# Altium schematic sheet power.SchDoc: Power
size Letter; Organization: NewAE Technology Inc.; Address1: 1083 Queen St., Suite 196; Address2: Halifax; Address3: NS; Address4: Canada B3H 0B2; SheetApproved: NO
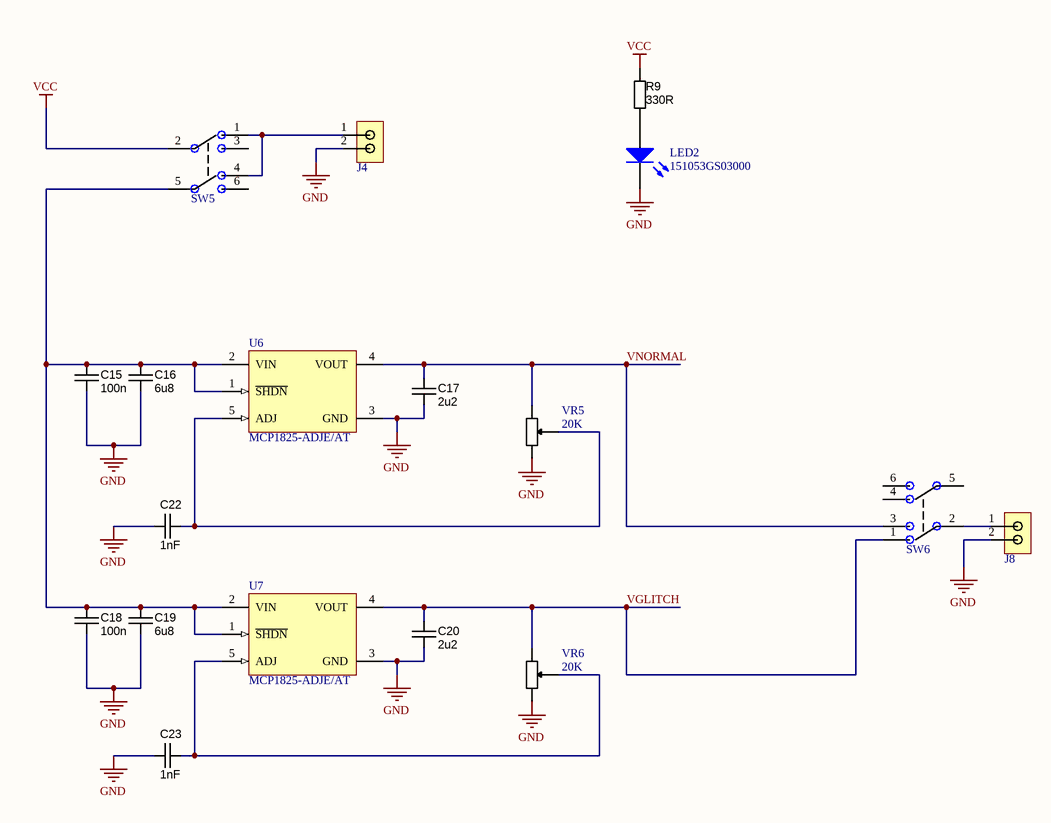
[diagram p0: power.SchDoc]

## Parts
C15  value 100n  [CAPC500P450250X550]  (hidden comment: approved sub OK)
C16  value 6u8  [CAPC500P450250X550]  (hidden comment: approved sub OK)
C17  value 2u2  [CAPC500P450250X550]  (hidden comment: approved sub OK)
C18  value 100n  [CAPC500P450250X550]  (hidden comment: approved sub OK)
C19  value 6u8  [CAPC500P450250X550]  (hidden comment: approved sub OK)
C20  value 2u2  [CAPC500P450250X550]  (hidden comment: approved sub OK)
C22  value 1nF  [CAPC500P450250X550]  (hidden comment: approved sub OK)
C23  value 1nF  [CAPC500P450250X550]  (hidden comment: approved sub OK)
J4  Jumper  [2x2.54mm_Header]  (value not drawn)
J8  Jumper  [2x2.54mm_Header]  (value not drawn)
LED2  151053GS03000  [Type 5mm]
R9  value 330R  [RESTH_AXIAL-0.4]  (hidden comment: Carbon Film)
SW5  EG2207  [EG2207]  (value not drawn)
SW6  EG2207  [EG2207]  (value not drawn)
U6  MCP1825-ADJE/AT  [TO-220-AT5]
U7  MCP1825-ADJE/AT  [TO-220-AT5]
VR5  20K  [RES_PDB18]
VR6  20K  [RES_PDB18]

## Nets
GND: C15.1 C16.1 C17.1 C18.1 C19.1 C20.1 C22.2 C23.2 J4.2 J8.2 LED2.1(K) U6.3(GND) U7.3(GND) VR5.3 VR6.3
VCC: R9.1 SW5.2(IN)
VGLITCH: C20.2 SW6.1(IN) U7.4(VOUT) VR6.1
VNORMAL: C17.2 SW6.3(IN) U6.4(VOUT) VR5.1
NetC15_2: C15.2 C16.2 C18.2 C19.2 SW5.5(IN) U6.1(~{SHDN}) U6.2(VIN) U7.1(~{SHDN}) U7.2(VIN)
NetC22_1: C22.1 U6.5(ADJ) VR5.2
NetC23_1: C23.1 U7.5(ADJ) VR6.2
NetJ4_1: J4.1 SW5.1(IN) SW5.4(IN)
NetJ8_1: J8.1 SW6.2(IN)
NetLED2_2: LED2.2(A) R9.2

Not connected (* = marked no-connect by the designer): SW5 3(IN) 6(IN); SW6 4(IN) 5(IN) 6(IN)

## Notes on the sheet
- Title:
- Date:
- Rev:
- Time:
- Project:
- Sheet
- of
- License:
- Copyright © NewAE Technology Inc.
- Approved:
- NewAE.com
- File:

## Library data of the parts
C15-C20 C22 C23 = CAPR_220n_Radial_5mm: Capacitor Ceramic 220nF 10% 50V X7R radial 5mm lead spacing; Manufacturer 1: TDK Corporation; Ratings: 50V; X7R; SCDType: spec; Tolerance: ±10%; Material: ceramic; Supplier 1: Digi-Key; Package / Case: 0.217" L x 0.177" W (5.50mm x 4.50mm) radial 5mm LS; Operating Temperature: -55°C ~ 125°C; ComponentLink1URL: http://www.tdk.co.jp/tefe02/e4941_fk.pdf; ComponentLink1Description: e4941_fk datasheet
J4 J8 = 2_PIN_JUMPER: 1x2 2.54mm header, male pins; Manufacture 1: Harwin; Manufacture Part Number 1: M20-9990246; Component Group: PCB Feature; PP Material Stack: 0; Part Number: 2_PIN_JUMPER; Pin Count: 2; Supplier 1: Digi-Key; Supplier Part Number 1: 952-2262-ND; Mounting Technology: Through-hole; RoHS: Yes; Component Kind: Standard; Component Type: Standard; PP Rotation: 0
LED2 = CMP-1489-00005-1: THT LED round mono-color waterclear, WL-TMRW, Green; Manufacturer: Wuerth Elektronik; ComponentLink2URL: http://katalog.we-online.de/pbs/datasheet/7448042001.pdfhttp://katalog.we-online.de/pbs/datasheet/7448042001.pdfhttp://katalog.we-online.de/pbs/datasheet/7448042001.pdfhttp://katalog.we-online.de/pbs/datasheet/151053GS03000.pdf; ComponentLink2Description: Datasheet; ComponentLink1URL: http://www.we-online.com; PackageReference: Type 5mm; ComponentLink1Description: Manufacturer URL; PartNumber: 151053GS03000; Emitting color: Green
R9 = RES_220R_Axial_0.25W_5%: Resistor THD Axial 10K Ohm 0.25W 5% Carbon Film; Manufacturer 1: Yageo; Manufacturer Part Number 1: CFR-25JB-220R; Ratings: 1/4W; SCDType: spec; Tolerance: ±5%; Package / Case: Axial; Supplier 1: Digi-Key; Supplier Part Number 1: 220QBK-ND
SW5 SW6 = EG2207: DPDT Switch with 2 MH; Manufacture 1: E-Switch; PP Material Stack: 0; Part Number: EG2207; Component Group: Switch; Manufacture Part Number 1: EG2207; Pin Count: 8; Supplier 1: Digi-Key; Supplier Part Number 1: EG1940-ND; Mounting Technology: Through-hole; RoHS: Yes; Component Kind: Standard; Component Type: Standard; PP Rotation: 0
U6 U7 = CMP-0136-01019-1: 500 mA, Low Voltage, Low Quiescent Current LDO Regulator, 5-Pin TO-220, Extended Temperature; PackageReference: TO-220-AT5; PackageVersion: revBB, Aug-2009; DatasheetVersion: revB, Feb-2008; PackageDescription: 5-Lead Plastic Transistor Outline (AT) [TO-220]
VR5 VR6 = POT_PDB181: POT 1/5W CARBON LINEAR VAR RESISTOR; Manufacture 1: Bourns; Manufacture Part Number 1: PDB181-K420K-203B; PP Material Stack: 0; Part Number: POT_PDB181; Component Group: Resistor; Pin Count: 3; Component Kind: Standard; Component Type: Standard; PP Rotation: 0